# EAGLE design Backplane_v1 (EAGLE 9.6.2)

## Sheet 1 of 3: MAIN
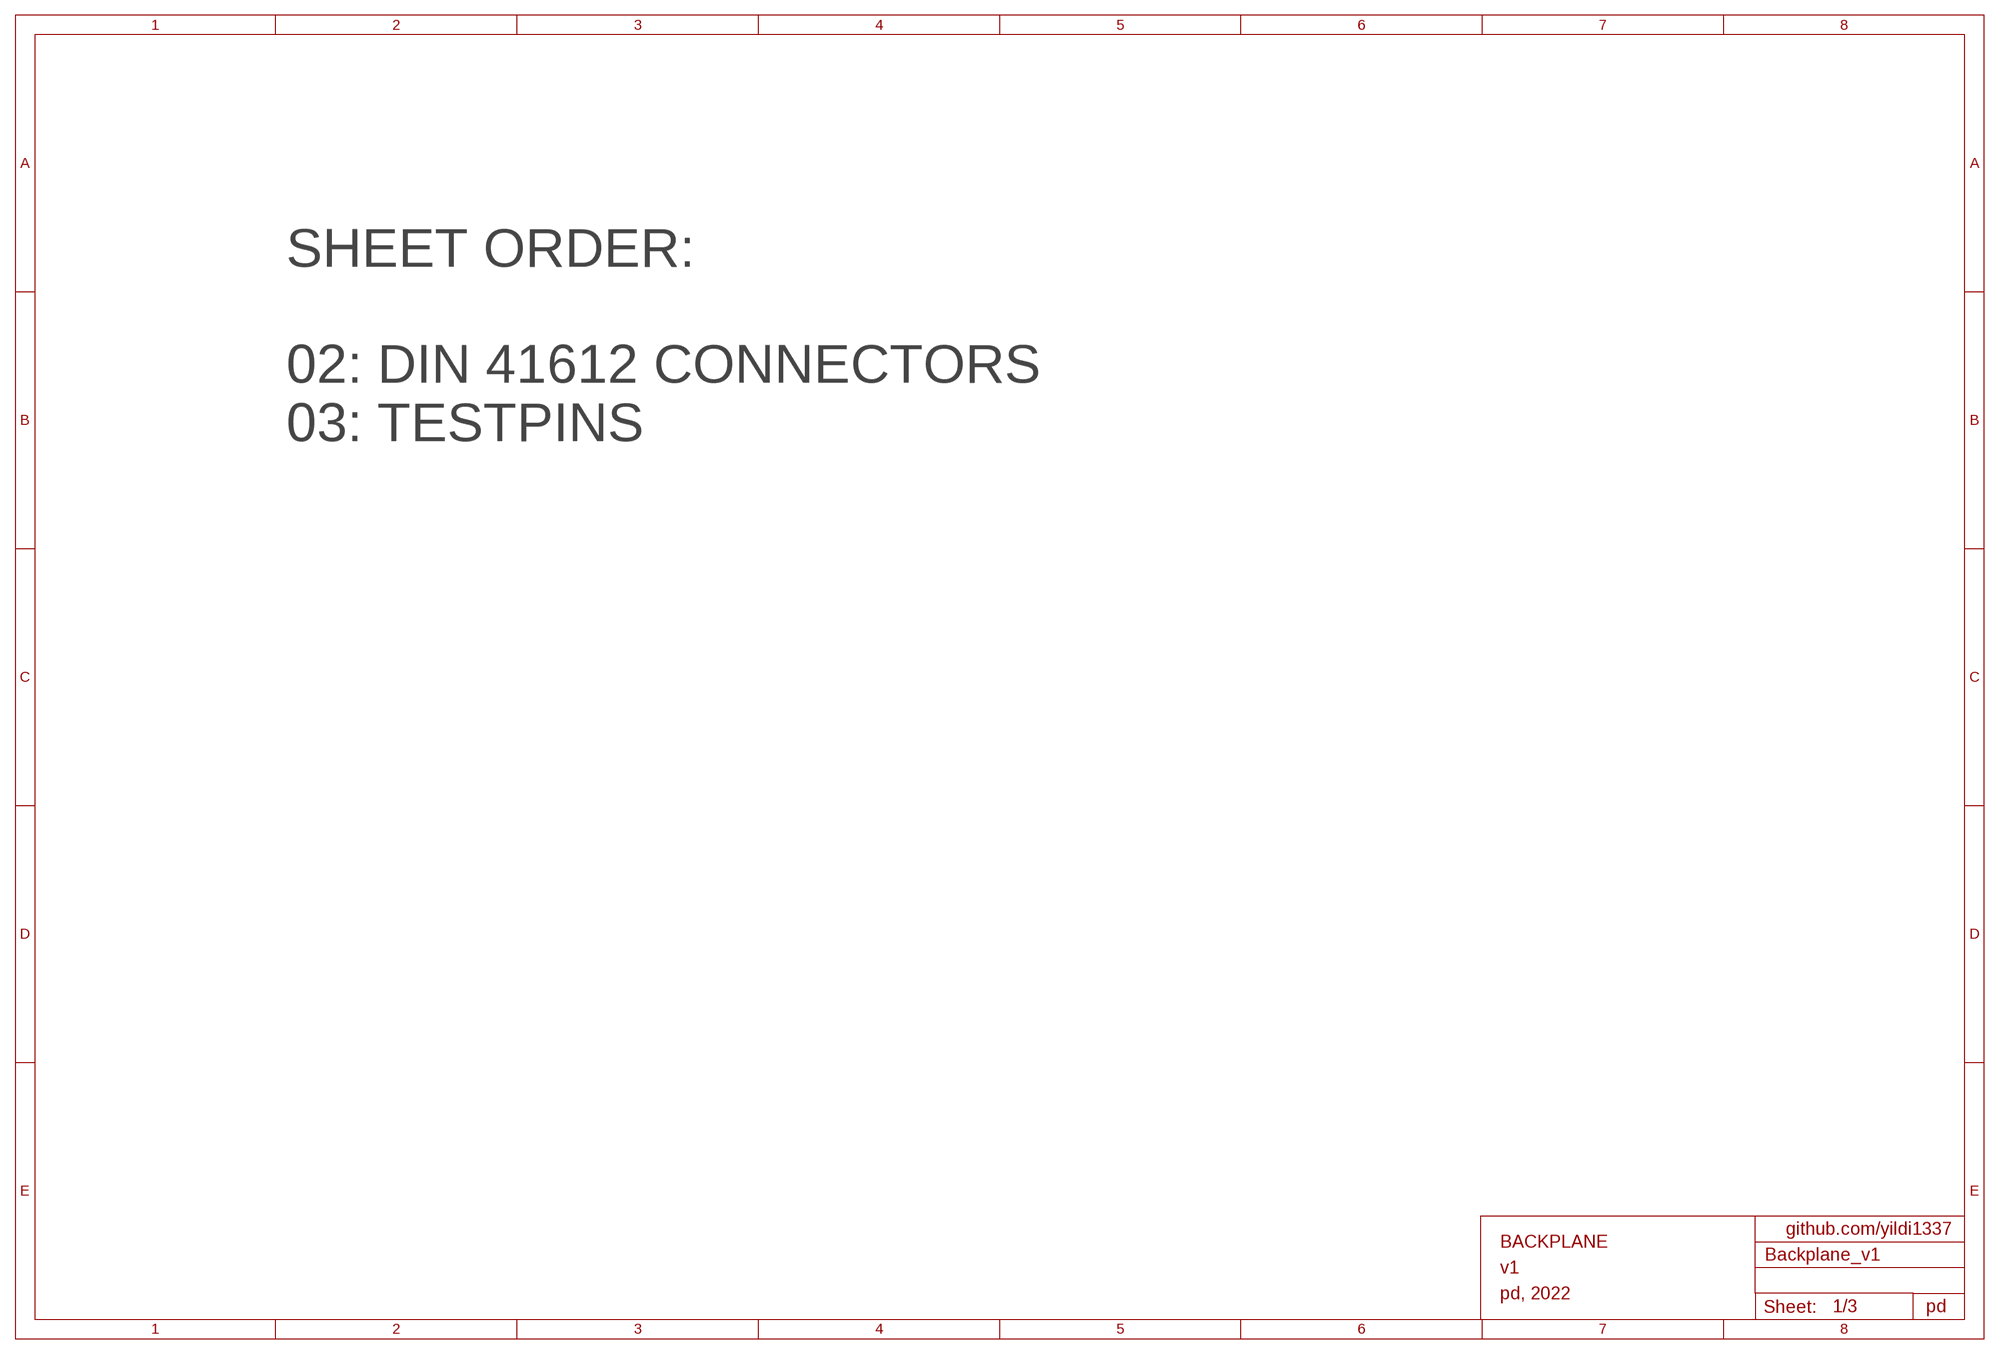
[diagram p0: schematic, sheet 1]

### Notes on the sheet
- SHEET ORDER:
  
  02: DIN 41612 CONNECTORS
  03: TESTPINS
- github.com/yildi1337
- BACKPLANE
- v1
- pd, 2022
- pd

## Sheet 2 of 3: DIN 41612 CONNECTORS
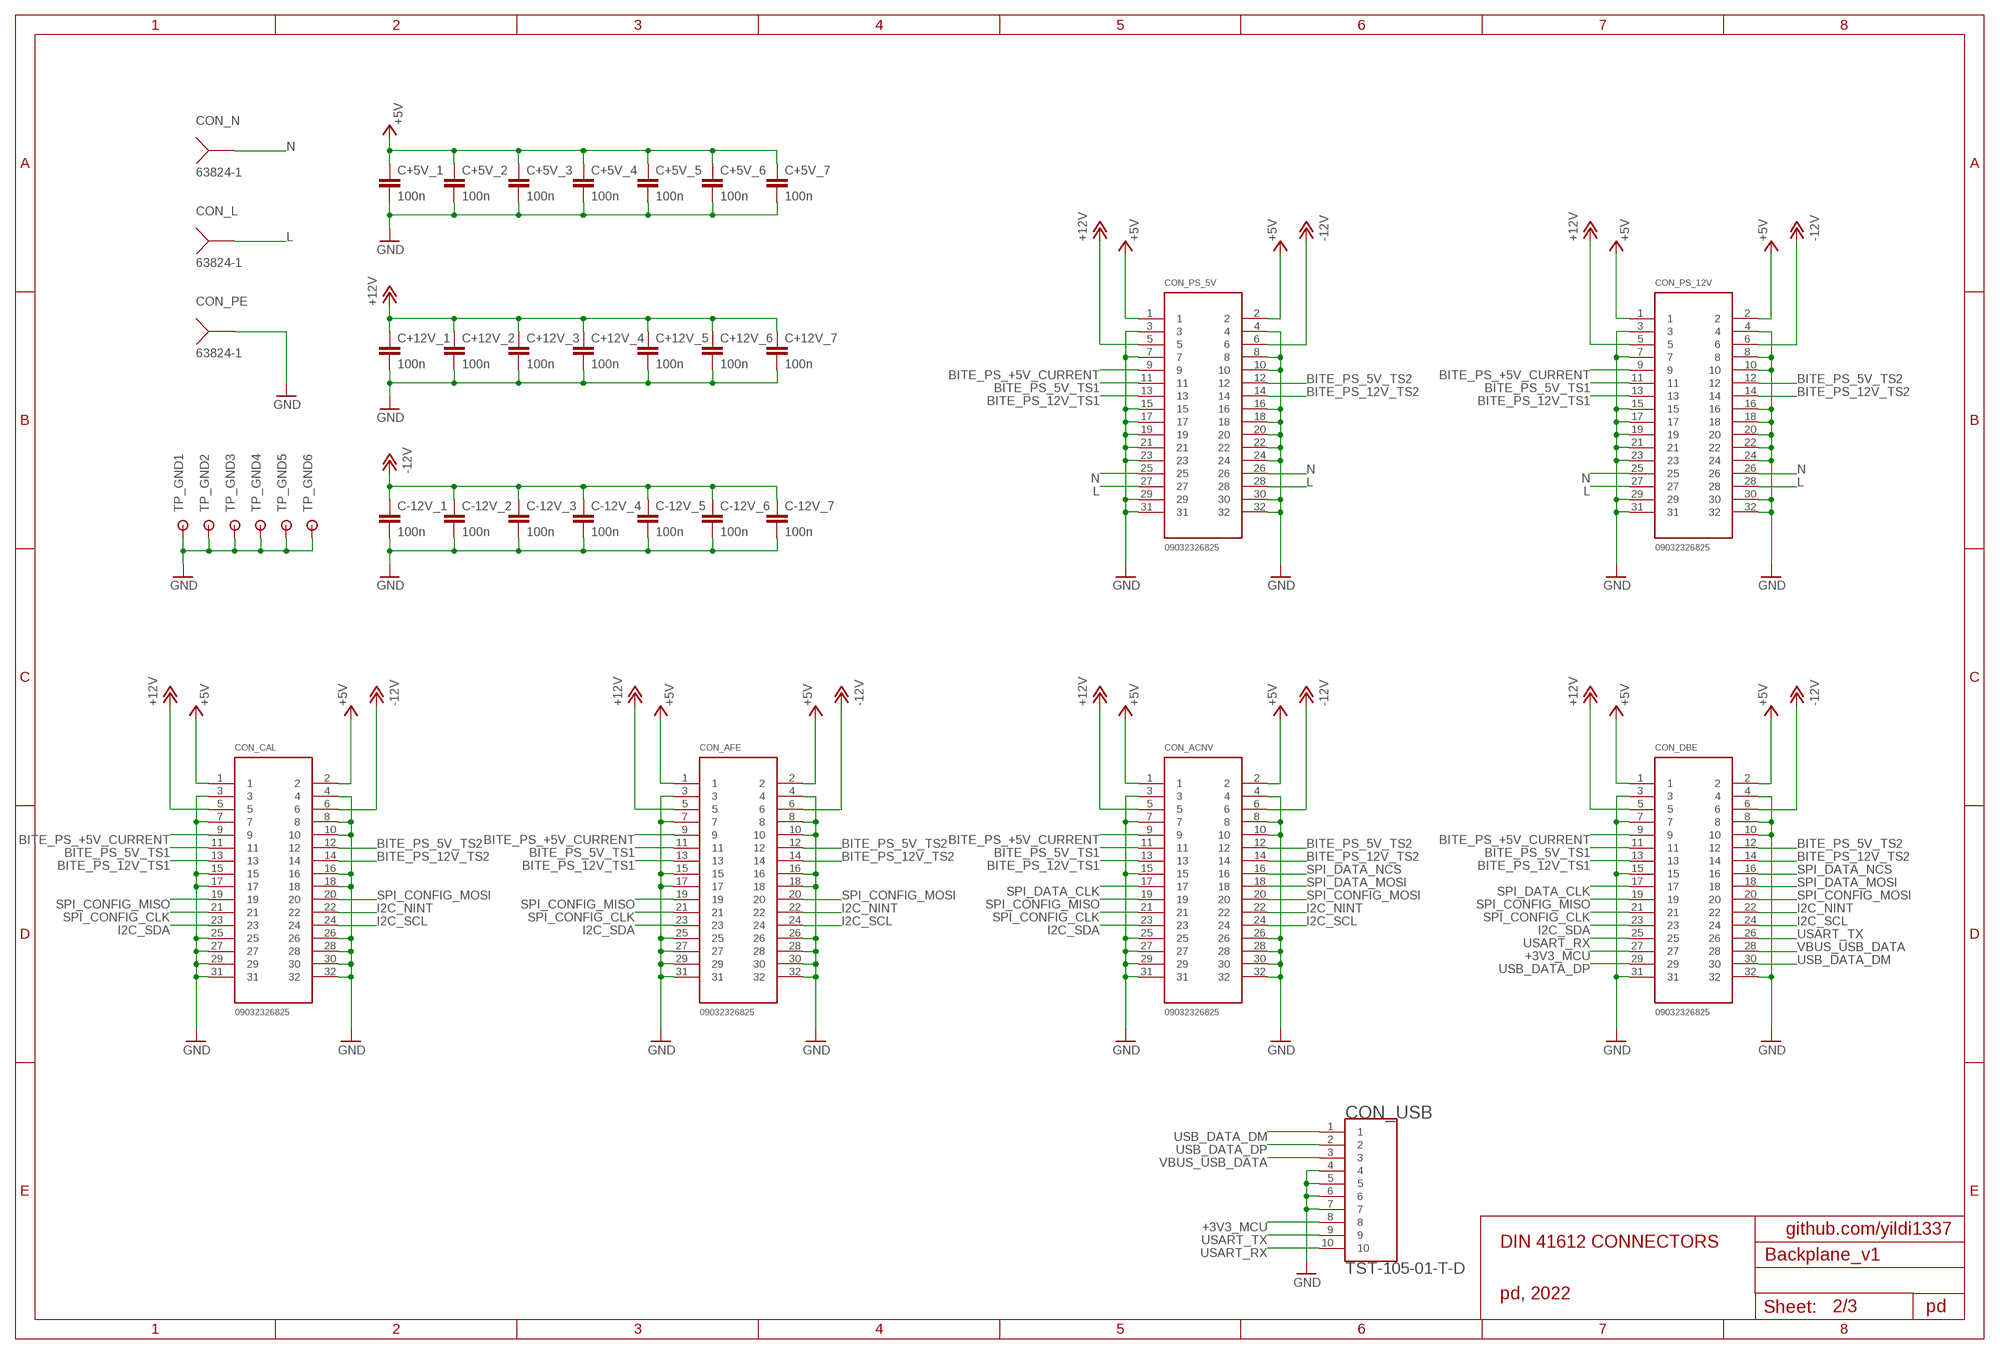
[diagram p1: schematic, sheet 2]

### Parts
C+5V_1  100n  C-EUC0603  [C0603]
C+5V_2  100n  C-EUC0603  [C0603]
C+5V_3  100n  C-EUC0603  [C0603]
C+5V_4  100n  C-EUC0603  [C0603]
C+5V_5  100n  C-EUC0603  [C0603]
C+5V_6  100n  C-EUC0603  [C0603]
C+5V_7  100n  C-EUC0603  [C0603]
C+12V_1  100n  C-EUC0603  [C0603]
C+12V_2  100n  C-EUC0603  [C0603]
C+12V_3  100n  C-EUC0603  [C0603]
C+12V_4  100n  C-EUC0603  [C0603]
C+12V_5  100n  C-EUC0603  [C0603]
C+12V_6  100n  C-EUC0603  [C0603]
C+12V_7  100n  C-EUC0603  [C0603]
C-12V_1  100n  C-EUC0603  [C0603]
C-12V_2  100n  C-EUC0603  [C0603]
C-12V_3  100n  C-EUC0603  [C0603]
C-12V_4  100n  C-EUC0603  [C0603]
C-12V_5  100n  C-EUC0603  [C0603]
C-12V_6  100n  C-EUC0603  [C0603]
C-12V_7  100n  C-EUC0603  [C0603]
CON_ACNV  09032326825  [09032326825]
CON_AFE  09032326825  [09032326825]
CON_CAL  09032326825  [09032326825]
CON_DBE  09032326825  [09032326825]
CON_L  63824-1  [63824-1]
CON_N  63824-1  [63824-1]
CON_PE  63824-1  [63824-1]
CON_PS_5V  09032326825  [09032326825]
CON_PS_12V  09032326825  [09032326825]
CON_USB  TST-105-01-T-D  [TST-105-01-T-D]
TP_GND1  RSPRO-1MM-TERMINAL-POST-2622034  [RSPRO-1MM-TERMINAL-POST-2622034]
TP_GND2  RSPRO-1MM-TERMINAL-POST-2622034  [RSPRO-1MM-TERMINAL-POST-2622034]
TP_GND3  RSPRO-1MM-TERMINAL-POST-2622034  [RSPRO-1MM-TERMINAL-POST-2622034]
TP_GND4  RSPRO-1MM-TERMINAL-POST-2622034  [RSPRO-1MM-TERMINAL-POST-2622034]
TP_GND5  RSPRO-1MM-TERMINAL-POST-2622034  [RSPRO-1MM-TERMINAL-POST-2622034]
TP_GND6  RSPRO-1MM-TERMINAL-POST-2622034  [RSPRO-1MM-TERMINAL-POST-2622034]

### Nets
+3V3_MCU: CON_DBE.27 CON_USB.8 ; also sheet 3
+5V: C+5V_1.1 C+5V_2.1 C+5V_3.1 C+5V_4.1 C+5V_5.1 C+5V_6.1 C+5V_7.1 CON_ACNV.1 CON_ACNV.2 CON_AFE.1 CON_AFE.2 CON_CAL.1 CON_CAL.2 CON_DBE.1 CON_DBE.2 CON_PS_5V.1 CON_PS_5V.2 CON_PS_12V.1 CON_PS_12V.2 ; also sheet 3
+12V: C+12V_1.1 C+12V_2.1 C+12V_3.1 C+12V_4.1 C+12V_5.1 C+12V_6.1 C+12V_7.1 CON_ACNV.5 CON_AFE.5 CON_CAL.5 CON_DBE.5 CON_PS_5V.5 CON_PS_12V.5 ; also sheet 3
-12V: C-12V_1.1 C-12V_2.1 C-12V_3.1 C-12V_4.1 C-12V_5.1 C-12V_6.1 C-12V_7.1 CON_ACNV.6 CON_AFE.6 CON_CAL.6 CON_DBE.6 CON_PS_5V.6 CON_PS_12V.6 ; also sheet 3
BITE_PS_5V_TS1: CON_ACNV.11 CON_AFE.11 CON_CAL.11 CON_DBE.11 CON_PS_5V.11 CON_PS_12V.11 ; also sheet 3
BITE_PS_5V_TS2: CON_ACNV.12 CON_AFE.12 CON_CAL.12 CON_DBE.12 CON_PS_5V.12 CON_PS_12V.12 ; also sheet 3
BITE_PS_12V_TS1: CON_ACNV.13 CON_AFE.13 CON_CAL.13 CON_DBE.13 CON_PS_5V.13 CON_PS_12V.13 ; also sheet 3
BITE_PS_12V_TS2: CON_ACNV.14 CON_AFE.14 CON_CAL.14 CON_DBE.14 CON_PS_5V.14 CON_PS_12V.14 ; also sheet 3
BITE_PS_+5V_CURRENT: CON_ACNV.9 CON_AFE.9 CON_CAL.9 CON_DBE.9 CON_PS_5V.9 CON_PS_12V.9 ; also sheet 3
GND: C+5V_1.2 C+5V_2.2 C+5V_3.2 C+5V_4.2 C+5V_5.2 C+5V_6.2 C+5V_7.2 C+12V_1.2 C+12V_2.2 C+12V_3.2 C+12V_4.2 C+12V_5.2 C+12V_6.2 C+12V_7.2 C-12V_1.2 C-12V_2.2 C-12V_3.2 C-12V_4.2 C-12V_5.2 C-12V_6.2 C-12V_7.2 CON_ACNV.3 CON_ACNV.4 CON_ACNV.7 CON_ACNV.8 CON_ACNV.10 CON_ACNV.15 CON_ACNV.25 CON_ACNV.26 CON_ACNV.27 CON_ACNV.28 CON_ACNV.29 CON_ACNV.30 CON_ACNV.31 CON_ACNV.32 CON_AFE.3 CON_AFE.4 CON_AFE.7 CON_AFE.8 CON_AFE.10 CON_AFE.15 CON_AFE.16 CON_AFE.17 CON_AFE.18 CON_AFE.25 CON_AFE.26 CON_AFE.27 CON_AFE.28 CON_AFE.29 CON_AFE.30 CON_AFE.31 CON_AFE.32 CON_CAL.3 CON_CAL.4 CON_CAL.7 CON_CAL.8 CON_CAL.10 CON_CAL.15 CON_CAL.16 CON_CAL.17 CON_CAL.18 CON_CAL.25 CON_CAL.26 CON_CAL.27 CON_CAL.28 CON_CAL.29 CON_CAL.30 CON_CAL.31 CON_CAL.32 CON_DBE.3 CON_DBE.4 CON_DBE.7 CON_DBE.8 CON_DBE.10 CON_DBE.15 CON_DBE.31 CON_DBE.32 CON_PE.1 CON_PE.2 CON_PS_5V.3 CON_PS_5V.4 CON_PS_5V.7 CON_PS_5V.8 CON_PS_5V.10 CON_PS_5V.15 CON_PS_5V.16 CON_PS_5V.17 CON_PS_5V.18 CON_PS_5V.19 CON_PS_5V.20 CON_PS_5V.21 CON_PS_5V.22 CON_PS_5V.23 CON_PS_5V.24 CON_PS_5V.29 CON_PS_5V.30 CON_PS_5V.31 CON_PS_5V.32 CON_PS_12V.3 CON_PS_12V.4 CON_PS_12V.7 CON_PS_12V.8 CON_PS_12V.10 CON_PS_12V.15 CON_PS_12V.16 CON_PS_12V.17 CON_PS_12V.18 CON_PS_12V.19 CON_PS_12V.20 CON_PS_12V.21 CON_PS_12V.22 CON_PS_12V.23 CON_PS_12V.24 CON_PS_12V.29 CON_PS_12V.30 CON_PS_12V.31 CON_PS_12V.32 CON_USB.4 CON_USB.5 CON_USB.6 CON_USB.7 TP_GND1.P$1 TP_GND2.P$1 TP_GND3.P$1 TP_GND4.P$1 TP_GND5.P$1 TP_GND6.P$1
I2C_NINT: CON_ACNV.22 CON_AFE.22 CON_CAL.22 CON_DBE.22 ; also sheet 3
I2C_SCL: CON_ACNV.24 CON_AFE.24 CON_CAL.24 CON_DBE.24 ; also sheet 3
I2C_SDA: CON_ACNV.23 CON_AFE.23 CON_CAL.23 CON_DBE.23 ; also sheet 3
L: CON_L.1 CON_L.2 CON_PS_5V.27 CON_PS_5V.28 CON_PS_12V.27 CON_PS_12V.28
N: CON_N.1 CON_N.2 CON_PS_5V.25 CON_PS_5V.26 CON_PS_12V.25 CON_PS_12V.26
SPI_CONFIG_CLK: CON_ACNV.21 CON_AFE.21 CON_CAL.21 CON_DBE.21 ; also sheet 3
SPI_CONFIG_MISO: CON_ACNV.19 CON_AFE.19 CON_CAL.19 CON_DBE.19 ; also sheet 3
SPI_CONFIG_MOSI: CON_ACNV.20 CON_AFE.20 CON_CAL.20 CON_DBE.20 ; also sheet 3
SPI_DATA_CLK: CON_ACNV.17 CON_DBE.17 ; also sheet 3
SPI_DATA_MOSI: CON_ACNV.18 CON_DBE.18 ; also sheet 3
SPI_DATA_NCS: CON_ACNV.16 CON_DBE.16 ; also sheet 3
USART_RX: CON_DBE.25 CON_USB.10 ; also sheet 3
USART_TX: CON_DBE.26 CON_USB.9 ; also sheet 3
USB_DATA_DM: CON_DBE.30 CON_USB.1 ; also sheet 3
USB_DATA_DP: CON_DBE.29 CON_USB.2 ; also sheet 3
VBUS_USB_DATA: CON_DBE.28 CON_USB.3 ; also sheet 3

### Notes on the sheet
- github.com/yildi1337
- DIN 41612 CONNECTORS
- pd, 2022
- pd

## Sheet 3 of 3: TESTPINS
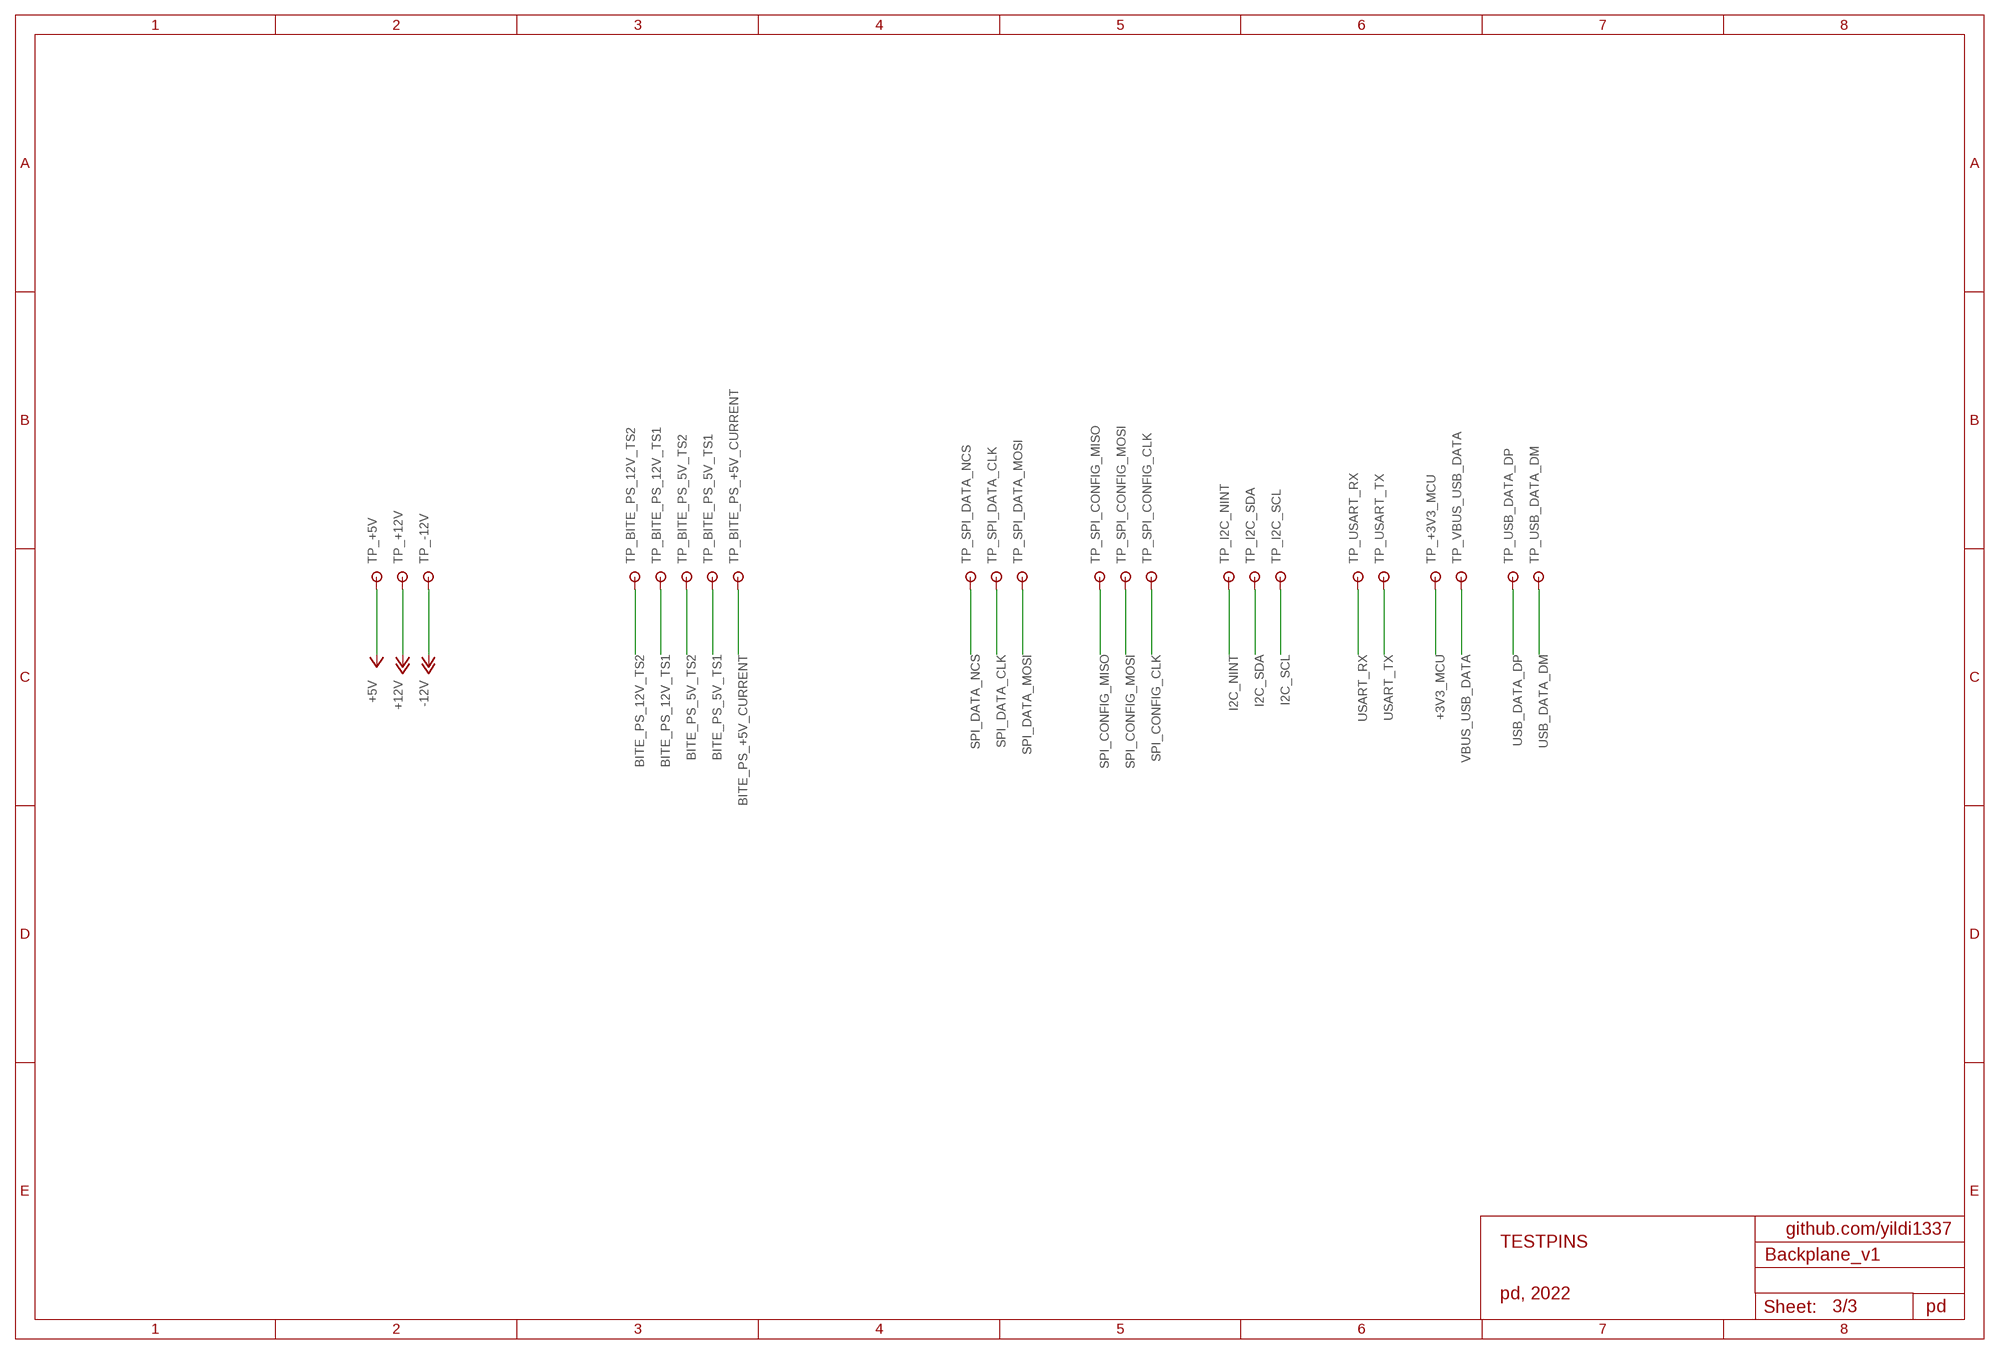
[diagram p2: schematic, sheet 3]

### Parts
TP_+3V3_MCU  RSPRO-1MM-TERMINAL-POST-2622034  [RSPRO-1MM-TERMINAL-POST-2622034]
TP_+5V  RSPRO-1MM-TERMINAL-POST-2622034  [RSPRO-1MM-TERMINAL-POST-2622034]
TP_+12V  RSPRO-1MM-TERMINAL-POST-2622034  [RSPRO-1MM-TERMINAL-POST-2622034]
TP_-12V  RSPRO-1MM-TERMINAL-POST-2622034  [RSPRO-1MM-TERMINAL-POST-2622034]
TP_BITE_PS_5V_TS1  RSPRO-1MM-TERMINAL-POST-2622034  [RSPRO-1MM-TERMINAL-POST-2622034]
TP_BITE_PS_5V_TS2  RSPRO-1MM-TERMINAL-POST-2622034  [RSPRO-1MM-TERMINAL-POST-2622034]
TP_BITE_PS_12V_TS1  RSPRO-1MM-TERMINAL-POST-2622034  [RSPRO-1MM-TERMINAL-POST-2622034]
TP_BITE_PS_12V_TS2  RSPRO-1MM-TERMINAL-POST-2622034  [RSPRO-1MM-TERMINAL-POST-2622034]
TP_BITE_PS_+5V_CURRENT  RSPRO-1MM-TERMINAL-POST-2622034  [RSPRO-1MM-TERMINAL-POST-2622034]
TP_I2C_NINT  RSPRO-1MM-TERMINAL-POST-2622034  [RSPRO-1MM-TERMINAL-POST-2622034]
TP_I2C_SCL  RSPRO-1MM-TERMINAL-POST-2622034  [RSPRO-1MM-TERMINAL-POST-2622034]
TP_I2C_SDA  RSPRO-1MM-TERMINAL-POST-2622034  [RSPRO-1MM-TERMINAL-POST-2622034]
TP_SPI_CONFIG_CLK  RSPRO-1MM-TERMINAL-POST-2622034  [RSPRO-1MM-TERMINAL-POST-2622034]
TP_SPI_CONFIG_MISO  RSPRO-1MM-TERMINAL-POST-2622034  [RSPRO-1MM-TERMINAL-POST-2622034]
TP_SPI_CONFIG_MOSI  RSPRO-1MM-TERMINAL-POST-2622034  [RSPRO-1MM-TERMINAL-POST-2622034]
TP_SPI_DATA_CLK  RSPRO-1MM-TERMINAL-POST-2622034  [RSPRO-1MM-TERMINAL-POST-2622034]
TP_SPI_DATA_MOSI  RSPRO-1MM-TERMINAL-POST-2622034  [RSPRO-1MM-TERMINAL-POST-2622034]
TP_SPI_DATA_NCS  RSPRO-1MM-TERMINAL-POST-2622034  [RSPRO-1MM-TERMINAL-POST-2622034]
TP_USART_RX  RSPRO-1MM-TERMINAL-POST-2622034  [RSPRO-1MM-TERMINAL-POST-2622034]
TP_USART_TX  RSPRO-1MM-TERMINAL-POST-2622034  [RSPRO-1MM-TERMINAL-POST-2622034]
TP_USB_DATA_DM  RSPRO-1MM-TERMINAL-POST-2622034  [RSPRO-1MM-TERMINAL-POST-2622034]
TP_USB_DATA_DP  RSPRO-1MM-TERMINAL-POST-2622034  [RSPRO-1MM-TERMINAL-POST-2622034]
TP_VBUS_USB_DATA  RSPRO-1MM-TERMINAL-POST-2622034  [RSPRO-1MM-TERMINAL-POST-2622034]

### Nets
+3V3_MCU: TP_+3V3_MCU.P$1 ; also sheet 2
+5V: TP_+5V.P$1 ; also sheet 2
+12V: TP_+12V.P$1 ; also sheet 2
-12V: TP_-12V.P$1 ; also sheet 2
BITE_PS_5V_TS1: TP_BITE_PS_5V_TS1.P$1 ; also sheet 2
BITE_PS_5V_TS2: TP_BITE_PS_5V_TS2.P$1 ; also sheet 2
BITE_PS_12V_TS1: TP_BITE_PS_12V_TS1.P$1 ; also sheet 2
BITE_PS_12V_TS2: TP_BITE_PS_12V_TS2.P$1 ; also sheet 2
BITE_PS_+5V_CURRENT: TP_BITE_PS_+5V_CURRENT.P$1 ; also sheet 2
I2C_NINT: TP_I2C_NINT.P$1 ; also sheet 2
I2C_SCL: TP_I2C_SCL.P$1 ; also sheet 2
I2C_SDA: TP_I2C_SDA.P$1 ; also sheet 2
SPI_CONFIG_CLK: TP_SPI_CONFIG_CLK.P$1 ; also sheet 2
SPI_CONFIG_MISO: TP_SPI_CONFIG_MISO.P$1 ; also sheet 2
SPI_CONFIG_MOSI: TP_SPI_CONFIG_MOSI.P$1 ; also sheet 2
SPI_DATA_CLK: TP_SPI_DATA_CLK.P$1 ; also sheet 2
SPI_DATA_MOSI: TP_SPI_DATA_MOSI.P$1 ; also sheet 2
SPI_DATA_NCS: TP_SPI_DATA_NCS.P$1 ; also sheet 2
USART_RX: TP_USART_RX.P$1 ; also sheet 2
USART_TX: TP_USART_TX.P$1 ; also sheet 2
USB_DATA_DM: TP_USB_DATA_DM.P$1 ; also sheet 2
USB_DATA_DP: TP_USB_DATA_DP.P$1 ; also sheet 2
VBUS_USB_DATA: TP_VBUS_USB_DATA.P$1 ; also sheet 2

### Notes on the sheet
- github.com/yildi1337
- TESTPINS
- pd, 2022
- pd

## Library data of the parts
C+5V_1-C+5V_7 C+12V_1-C+12V_7 C-12V_1-C-12V_7 = rcl:C-EU: CAPACITOR, European symbol; SPICEPREFIX: C
CON_ACNV CON_AFE CON_CAL CON_DBE CON_PS_5V CON_PS_12V = 09032326825:09032326825
CON_L CON_N CON_PE = 63824-1:63824-1
CON_USB = TST-105-01-T-D:TST-105-01-T-D
TP_+3V3_MCU TP_+5V TP_+12V TP_-12V TP_BITE_PS_5V_TS1 TP_BITE_PS_5V_TS2 TP_BITE_PS_12V_TS1 TP_BITE_PS_12V_TS2 TP_BITE_PS_+5V_CURRENT TP_GND1-TP_GND6 TP_I2C_NINT TP_I2C_SCL TP_I2C_SDA TP_SPI_CONFIG_CLK TP_SPI_CONFIG_MISO TP_SPI_CONFIG_MOSI TP_SPI_DATA_CLK TP_SPI_DATA_MOSI TP_SPI_DATA_NCS TP_USART_RX TP_USART_TX TP_USB_DATA_DM TP_USB_DATA_DP TP_VBUS_USB_DATA = RSPRO-1MM-TERMINAL-POST-2622034:RSPRO-1MM-TERMINAL-POST-2622034

## Board
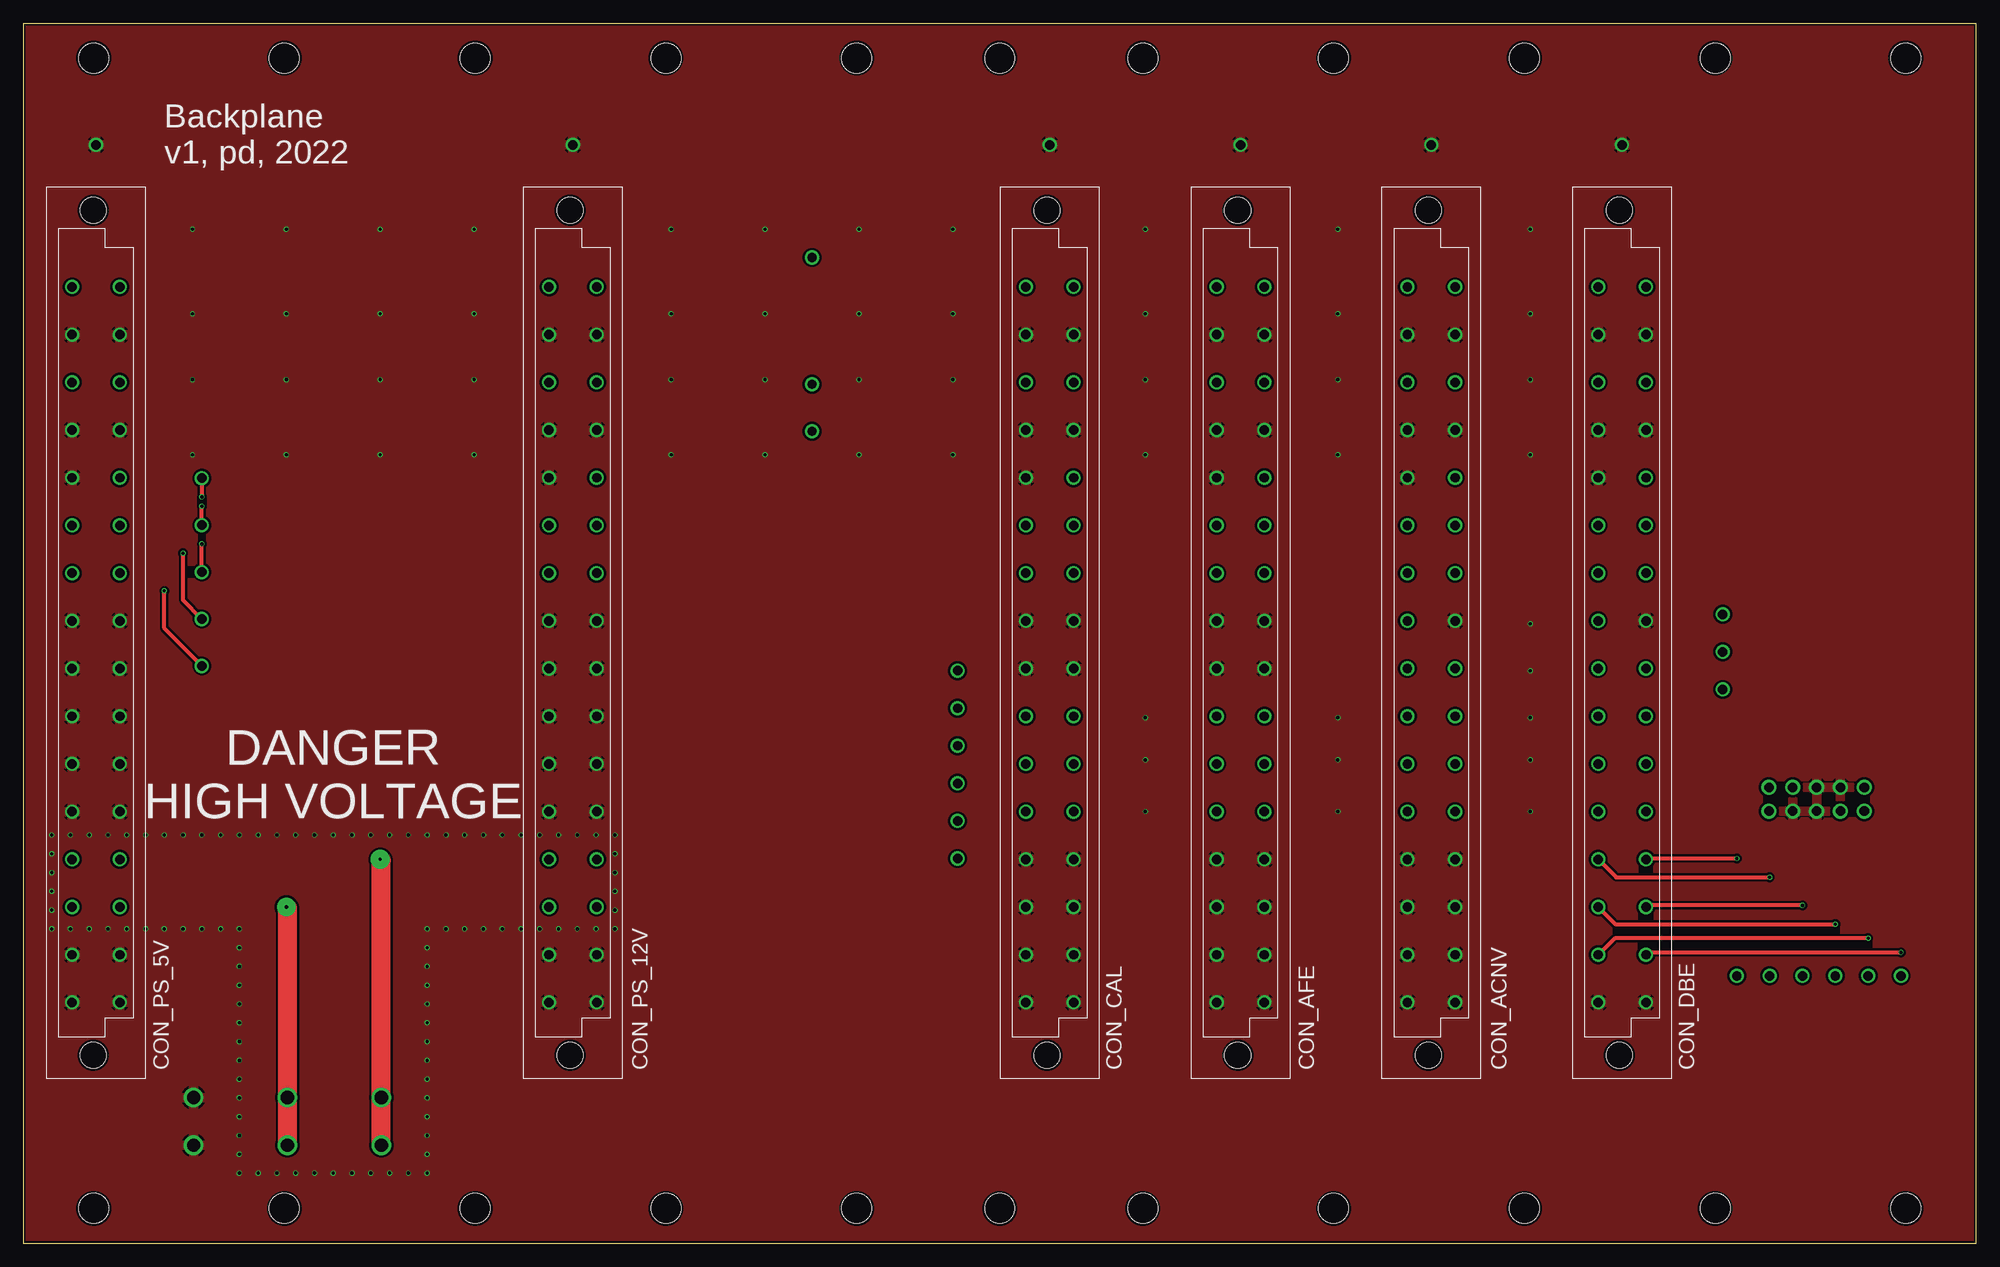
[diagram p3: board, top side]
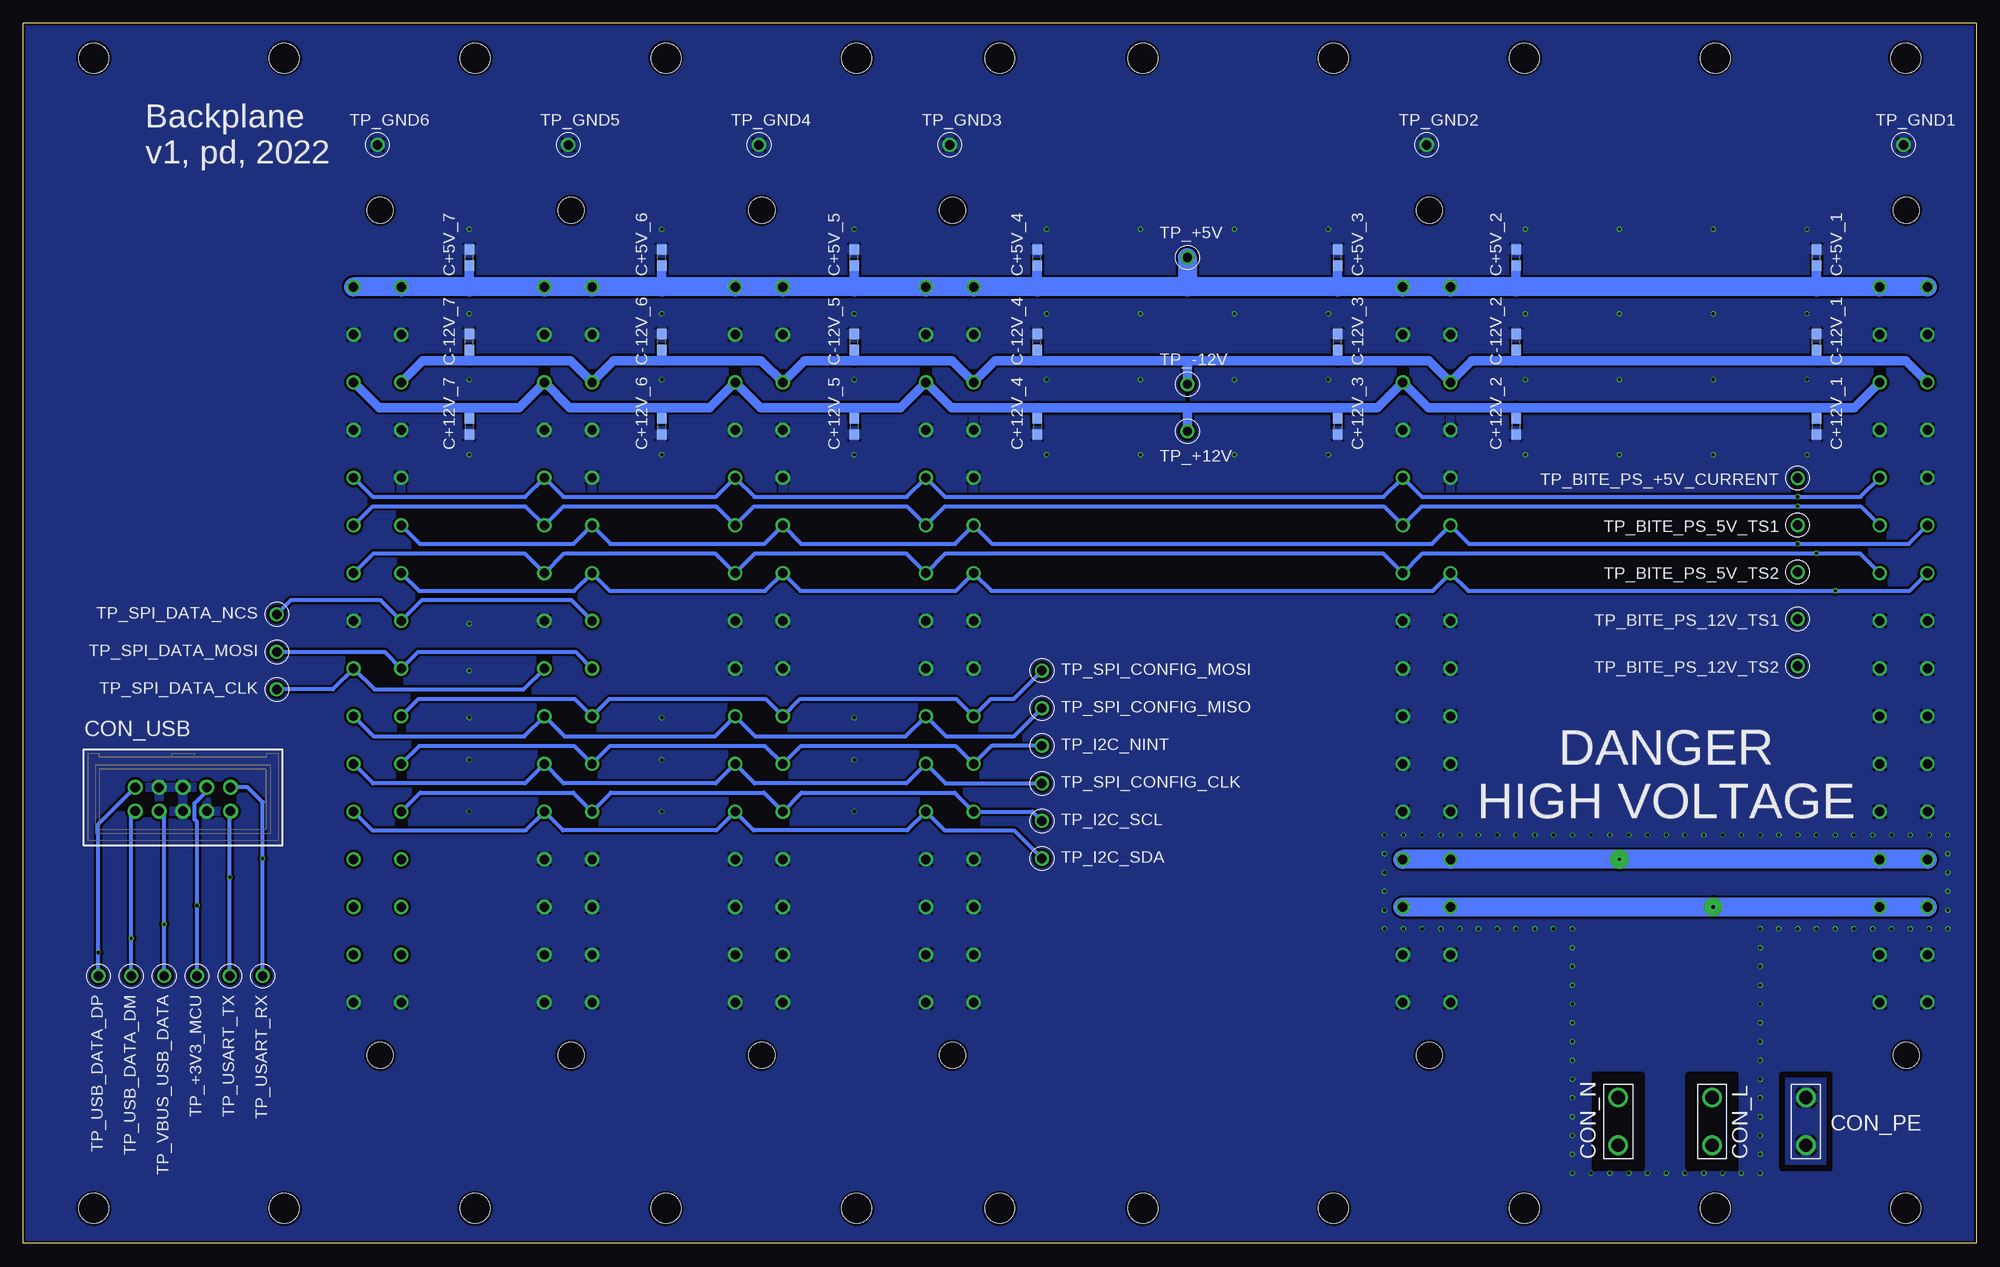
[diagram p4: board, bottom side, seen from below]

Size 207.99 x 129.92 mm. Coordinates in mm from the lower left corner, seen from the top.
Outline: 0,0 207.99,0 207.99,129.92 0,129.92 0,0
Copper layers (1*16): Top 0.035559375mm / dielectric 1.6mm / Bottom 0.035559375mm
Design rules "jlcpcb2layer": minimum track width 5mil, minimum drill 12mil, track to track 5mil, track to pad 5mil, pad to pad 5mil, via to via 5mil, smd to smd 5mil, copper to edge 8mil, drill to drill 6mil, minimum pad ring 5mil, minimum via ring 3mil, stop-mask expansion 2.5mil, vias tented up to drill 0mil, thermal gap 10mil
Holes 3.2 mm at 7.47,126.24 7.47,3.73 200.51,126.24 200.51,3.73 103.99,3.73 27.79,126.24 48.11,126.24 68.43,126.24 88.75,126.24 119.23,126.24 139.55,126.24 159.87,126.24 180.19,126.24 27.79,3.73 48.11,3.73 68.43,3.73 88.75,3.73 103.99,126.24 119.23,3.73 139.55,3.73 159.87,3.73 180.19,3.73

### Footprints (pad centres in the part's own frame; a part is rotated, then mirrored left to right if it is on the bottom)
C0603 = smd 1.1 x 1: 1 -0.85,0; 2 0.85,0
09032326825 = drill 1: 1 36.83,-2.54; 2 36.83,2.54; 3 31.75,-2.54; 4 31.75,2.54; 5 26.67,-2.54; 6 26.67,2.54; 7 21.59,-2.54; 8 21.59,2.54; 9 16.51,-2.54; 10 16.51,2.54; 11 11.43,-2.54; 12 11.43,2.54; 13 6.35,-2.54; 14 6.35,2.54; 15 1.27,-2.54; 16 1.27,2.54; 17 -3.81,-2.54; 18 -3.81,2.54; 19 -8.89,-2.54; 20 -8.89,2.54; 21 -13.97,-2.54; 22 -13.97,2.54; 23 -19.05,-2.54; 24 -19.05,2.54; 25 -24.13,-2.54; 26 -24.13,2.54; 27 -29.21,-2.54; 28 -29.21,2.54; 29 -34.29,-2.54; 30 -34.29,2.54; 31 -39.37,-2.54; 32 -39.37,2.54 | hole 2.8: -45,0.3; 45,0.3
63824-1 = drill 1.4: 1 -2.54,0; 2 2.54,0
TST-105-01-T-D = drill 1.02 pad 1.62: 1 -5.08,-1.46; 2 -5.08,1.08; 3 -2.54,-1.46; 4 -2.54,1.08; 5 0,-1.46; 6 0,1.08; 7 2.54,-1.46; 8 2.54,1.08; 9 5.08,-1.46; 10 5.08,1.08
RSPRO-1MM-TERMINAL-POST-2622034 = drill 1: P$1 0,0

### Placement (x,y rotation side)
C+5V_1  17,105 90 bottom
C+5V_2  49,105 90 bottom
C+5V_3  68,105 90 bottom
C+5V_4  100,105 90 bottom
C+5V_5  119.5,105 90 bottom
C+5V_6  140,105 90 bottom
C+5V_7  160.5,105 90 bottom
C+12V_1  17,87 270 bottom
C+12V_2  49,87 270 bottom
C+12V_3  68,87 270 bottom
C+12V_4  100,87 270 bottom
C+12V_5  119.5,87 270 bottom
C+12V_6  140,87 270 bottom
C+12V_7  160.5,87 270 bottom
C-12V_1  17,96 90 bottom
C-12V_2  49,96 90 bottom
C-12V_3  68,96 90 bottom
C-12V_4  100,96 90 bottom
C-12V_5  119.5,96 90 bottom
C-12V_6  140,96 90 bottom
C-12V_7  160.5,96 90 bottom
CON_ACNV  149.96,65.04 90 top
CON_AFE  129.64,65.04 90 top
CON_CAL  109.32,65.04 90 top
CON_DBE  170.28,65.04 90 top
CON_L  28.12,13 270 bottom
CON_N  38.12,13 270 bottom
CON_PE  18.12,13 90 bottom
CON_PS_5V  7.72,65.04 90 top
CON_PS_12V  58.52,65.04 90 top
CON_USB  191,47.5 0 bottom
TP_+3V3_MCU  189.5,28.5 270 bottom
TP_+5V  84,105 0 bottom
TP_+12V  84,86.5 0 bottom
TP_-12V  84,91.5 0 bottom
TP_BITE_PS_5V_TS1  19,76.5 0 bottom
TP_BITE_PS_5V_TS2  19,71.5 0 bottom
TP_BITE_PS_12V_TS1  19,66.5 180 bottom
TP_BITE_PS_12V_TS2  19,61.5 180 bottom
TP_BITE_PS_+5V_CURRENT  19,81.5 0 bottom
TP_GND1  7.72,117 0 bottom
TP_GND2  58.52,117 0 bottom
TP_GND3  109.32,117 0 bottom
TP_GND4  129.64,117 0 bottom
TP_GND5  149.96,117 0 bottom
TP_GND6  170.28,117 0 bottom
TP_I2C_NINT  99.5,53 0 bottom
TP_I2C_SCL  99.5,45 0 bottom
TP_I2C_SDA  99.5,41 0 bottom
TP_SPI_CONFIG_CLK  99.5,49 0 bottom
TP_SPI_CONFIG_MISO  99.5,57 0 bottom
TP_SPI_CONFIG_MOSI  99.5,61 0 bottom
TP_SPI_DATA_CLK  181,59 0 bottom
TP_SPI_DATA_MOSI  181,63 0 bottom
TP_SPI_DATA_NCS  181,67 0 bottom
TP_USART_RX  182.5,28.5 270 bottom
TP_USART_TX  186,28.5 270 bottom
TP_USB_DATA_DM  196.5,28.5 270 bottom
TP_USB_DATA_DP  200,28.5 270 bottom
TP_VBUS_USB_DATA  193,28.5 270 bottom

### Tracks (layer width: path | path; a pad name or v marks a point on that pad's centre or on a via)
+3V3_MCU  (via drill 0.35)
  Top 0.406: v189.5,36 172.99,36 CON_DBE.27
  Bottom 0.406: TP_+3V3_MCU.P$1 v189.5,36 189.5,44.9 189.75,45.15 189.75,46.89 188.46,48.18 CON_USB.8
+5V
  Bottom 1: C+5V_1.1 17,101.87 | C+5V_2.1 49,101.87 | C+5V_3.1 68,101.87 | C+5V_4.1 100,101.87 | C+5V_5.1 119.5,101.87 | C+5V_6.1 140,101.87 | C+5V_7.1 160.5,101.87
  Bottom 2: CON_PS_5V.2 CON_PS_5V.1 17,101.87 49,101.87 CON_PS_12V.2 CON_PS_12V.1 68,101.87 84,101.87 | 84,101.87 100,101.87 CON_CAL.2 CON_CAL.1 119.5,101.87 CON_AFE.2 CON_AFE.1 140,101.87 CON_ACNV.2 CON_ACNV.1 160.5,101.87 CON_DBE.2 CON_DBE.1 | TP_+5V.P$1 84,101.87
+12V
  Bottom 1: CON_PS_5V.5 12.97,89 17,89 | 49,89 58.35,89 CON_PS_12V.5 63.77,89 68,89 | 49,89 17,89 | 100,89 109.15,89 CON_CAL.5 114.57,89 119.5,89 | 100,89 84,89 | 84,89 68,89 | C+12V_4.1 100,89 | C+12V_3.1 68,89 | C+12V_2.1 49,89 | C+12V_1.1 17,89 | 119.5,89 129.47,89 CON_AFE.5 134.89,89 140,89 | 140,89 149.79,89 CON_ACNV.5 155.21,89 160.5,89 | CON_DBE.5 170.11,89 160.5,89 | C+12V_5.1 119.5,89 | C+12V_6.1 140,89 | C+12V_7.1 160.5,89 | TP_+12V.P$1 84,89
-12V
  Bottom 1: CON_PS_5V.6 7.47,94 17,94 | 17,94 49,94 | 49,94 53.69,94 CON_PS_12V.6 58.27,94 68,94 | 68,94 84,94 | 84,94 100,94 | 100,94 104.49,94 CON_CAL.6 109.07,94 119.5,94 | C-12V_1.1 17,94 | C-12V_2.1 49,94 | C-12V_3.1 68,94 | C-12V_4.1 100,94 | 119.5,94 124.81,94 CON_AFE.6 129.39,94 140,94 | 140,94 145.13,94 CON_ACNV.6 149.71,94 160.5,94 | CON_DBE.6 165.45,94 160.5,94 | C-12V_7.1 160.5,94 | C-12V_6.1 140,94 | C-12V_5.1 119.5,94 | TP_-12V.P$1 84,94
BITE_PS_5V_TS1  (via drill 0.35)
  Top 0.406: TP_BITE_PS_5V_TS1.P$1 v19,78.5
  Bottom 0.406: CON_DBE.11 170.79,78.5 154.53,78.5 CON_ACNV.11 150.47,78.5 134.21,78.5 CON_AFE.11 130.15,78.5 113.89,78.5 CON_CAL.11 109.83,78.5 63.09,78.5 CON_PS_12V.11 59.03,78.5 v19,78.5 12.29,78.5 CON_PS_5V.11
BITE_PS_5V_TS2  (via drill 0.35)
  Top 0.406: TP_BITE_PS_5V_TS2.P$1 v19,74.5
  Bottom 0.406: CON_DBE.12 165.77,74.5 149.39,74.5 CON_ACNV.12 145.45,74.5 129.07,74.5 CON_AFE.12 125.13,74.5 108.75,74.5 CON_CAL.12 104.81,74.5 57.95,74.5 CON_PS_12V.12 54.01,74.5 v19,74.5 7.15,74.5 CON_PS_5V.12
BITE_PS_12V_TS1  (via drill 0.35)
  Top 0.406: TP_BITE_PS_12V_TS1.P$1 17,68.5 v17,73.5
  Bottom 0.406: CON_DBE.13 170.71,73.5 154.61,73.5 CON_ACNV.13 150.39,73.5 134.29,73.5 CON_AFE.13 130.07,73.5 113.97,73.5 CON_CAL.13 109.75,73.5 63.17,73.5 CON_PS_12V.13 58.95,73.5 v17,73.5 12.37,73.5 CON_PS_5V.13
BITE_PS_12V_TS2  (via drill 0.35)
  Top 0.406: TP_BITE_PS_12V_TS2.P$1 15,65.5 v15,69.5
  Bottom 0.406: CON_DBE.14 165.85,69.5 149.31,69.5 CON_ACNV.14 145.53,69.5 128.99,69.5 CON_AFE.14 125.21,69.5 108.67,69.5 CON_CAL.14 104.89,69.5 57.87,69.5 CON_PS_12V.14 54.09,69.5 v15,69.5 7.07,69.5 CON_PS_5V.14
BITE_PS_+5V_CURRENT  (via drill 0.35)
  Top 0.406: TP_BITE_PS_+5V_CURRENT.P$1 v19,79.5
  Bottom 0.406: CON_DBE.9 170.77,79.5 154.55,79.5 CON_ACNV.9 150.45,79.5 134.23,79.5 CON_AFE.9 130.13,79.5 113.91,79.5 CON_CAL.9 109.81,79.5 63.11,79.5 CON_PS_12V.9 59.01,79.5 v19,79.5 12.31,79.5 CON_PS_5V.9
GND  (via drill 0.35)
  other vias: 18,92 28,92 38,92 48,92 18,84 28,84 38,84 48,84 18,99 28,99 38,99 48,99 69,99 79,99 89,99 99,99 69,92 79,92 89,92 99,92 69,84 79,84 89,84 99,84 119.5,99 119.5,92 119.5,84 140,99 140,92 140,84 160.5,84 160.5,92 160.5,99 119.5,108 140,108 160.5,108 119.5,56 119.5,46 140,56 140,46 140,51.5 119.5,51.5 160.5,51.5 160.5,56 160.5,46 160.5,61 160.5,66 43,7.5 41,7.5 43,11.5 43,13.5 43,15.5 43,17.5 43,19.5 43,21.5 43,23.5 43,25.5 43,27.5 43,29.5 43,31.5 43,33.5 47,33.5 49,33.5 51,33.5 53,33.5 55,33.5 39,7.5 37,7.5 35,7.5 31,7.5 43,9.5 29,7.5 27,7.5 25,7.5 23,7.5 23,9.5 23,11.5 23,13.5 23,15.5 23,17.5 23,19.5 23,21.5 23,23.5 23,25.5 23,27.5 23,29.5 23,31.5 21,33.5 57,33.5 59,33.5 61,33.5 63,33.5 3,33.5 5,33.5 7,33.5 9,33.5 11,33.5 13,33.5 15,33.5 17,33.5 19,33.5 3,35.5 3,37.5 3,39.5 3,41.5 3,43.5 5,43.5 7,43.5 9,43.5 11,43.5 63,35.5 63,37.5 63,39.5 63,41.5 63,43.5 61,43.5 59,43.5 57,43.5 55,43.5 53,43.5 51,43.5 49,43.5 47,43.5 45,43.5 43,43.5 41,43.5 39,43.5 37,43.5 35,43.5 33,43.5 31,43.5 29,43.5 27,43.5 25,43.5 23,43.5 21,43.5 19,43.5 17,43.5 15,43.5 13,43.5 33,7.5 18,108 28,108 38,108 48,108 69,108 79,108 89,108 99,108 23,33.5 45,33.5
  pour Bottom (isolate 0.25): 0,0 0,130 208,130 208,0
  pour Top (isolate 0.25): 0,0 0,130 208,130 208,0
I2C_NINT
  Bottom 0.406: CON_DBE.22 165.81,53 149.35,53 CON_ACNV.22 145.49,53 129.03,53 CON_AFE.22 125.17,53 108.71,53 CON_CAL.22 104.85,53 TP_I2C_NINT.P$1
I2C_SCL
  Bottom 0.406: CON_DBE.24 165.73,48 149.43,48 CON_ACNV.24 145.41,48 129.11,48 CON_AFE.24 125.09,48 108.79,48 CON_CAL.24 100.49,45.99 TP_I2C_SCL.P$1
I2C_SDA
  Bottom 0.406: CON_DBE.23 170.83,44 154.49,44 CON_ACNV.23 150.51,44 134.17,44 CON_AFE.23 130.19,44 113.85,44 CON_CAL.23 109.87,44 102.5,44 TP_I2C_SDA.P$1
L  (via drill 0.35 pad 2)
  Top 2: CON_L.2 CON_L.1 28.12,35.71 v28,35.83
  Bottom 2: CON_PS_5V.28 CON_PS_5V.27 v28,35.83 CON_PS_12V.28 CON_PS_12V.27
N  (via drill 0.35 pad 2)
  Top 2: CON_N.2 CON_N.1 38.12,40.79 v38,40.91
  Bottom 2: CON_PS_5V.26 CON_PS_5V.25 v38,40.91 CON_PS_12V.26 CON_PS_12V.25
SPI_CONFIG_CLK
  Bottom 0.406: CON_DBE.21 170.75,49 154.57,49 CON_ACNV.21 150.43,49 134.25,49 CON_AFE.21 130.11,49 113.93,49 CON_CAL.21 109.79,49 TP_SPI_CONFIG_CLK.P$1
SPI_CONFIG_MISO
  Bottom 0.406: CON_DBE.19 170.67,54 154.65,54 CON_ACNV.19 150.35,54 134.33,54 CON_AFE.19 130.03,54 114.01,54 CON_CAL.19 109.71,54 102.5,54 TP_SPI_CONFIG_MISO.P$1
SPI_CONFIG_MOSI
  Bottom 0.406: CON_DBE.20 165.89,58 149.27,58 CON_ACNV.20 145.57,58 128.95,58 CON_AFE.20 125.25,58 108.63,58 CON_CAL.20 104.93,58 102.5,58 TP_SPI_CONFIG_MOSI.P$1
SPI_DATA_CLK
  Bottom 0.406: CON_ACNV.17 154.73,59 170.59,59 CON_DBE.17 175.05,59 TP_SPI_DATA_CLK.P$1
SPI_DATA_MOSI
  Bottom 0.406: CON_ACNV.18 149.19,63 165.97,63 CON_DBE.18 169.51,63 TP_SPI_DATA_MOSI.P$1
SPI_DATA_NCS
  Bottom 0.406: CON_ACNV.16 149.61,68.5 165.55,68.5 CON_DBE.16 169.93,68.5 179.5,68.5 TP_SPI_DATA_NCS.P$1
USART_RX  (via drill 0.35)
  Top 0.406: CON_DBE.25 172.91,41 v182.5,41
  Bottom 0.406: TP_USART_RX.P$1 v182.5,41 182.5,47 184.08,48.58 CON_USB.10
USART_TX  (via drill 0.35)
  Top 0.406: CON_DBE.26 169.65,39 v186,39
  Bottom 0.406: TP_USART_TX.P$1 v186,39 186,45.96 CON_USB.9
USB_DATA_DM  (via drill 0.35)
  Top 0.406: CON_DBE.30 169.49,32.5 v196.5,32.5
  Bottom 0.406: TP_USB_DATA_DM.P$1 v196.5,32.5 196.5,45.62 CON_USB.1
USB_DATA_DP  (via drill 0.35)
  Top 0.406: CON_DBE.29 173.07,31 v200,31
  Bottom 0.406: TP_USB_DATA_DP.P$1 v200,31 200,44.66 CON_USB.2
VBUS_USB_DATA  (via drill 0.35)
  Top 0.406: CON_DBE.28 169.57,34 v193,34
  Bottom 0.406: TP_VBUS_USB_DATA.P$1 v193,34 193,45.5 CON_USB.3

### Text on the board
tPlace: Backplane / v1, pd, 2022 | DANGER / HIGH VOLTAGE
bPlace: Backplane / v1, pd, 2022 | DANGER / HIGH VOLTAGE